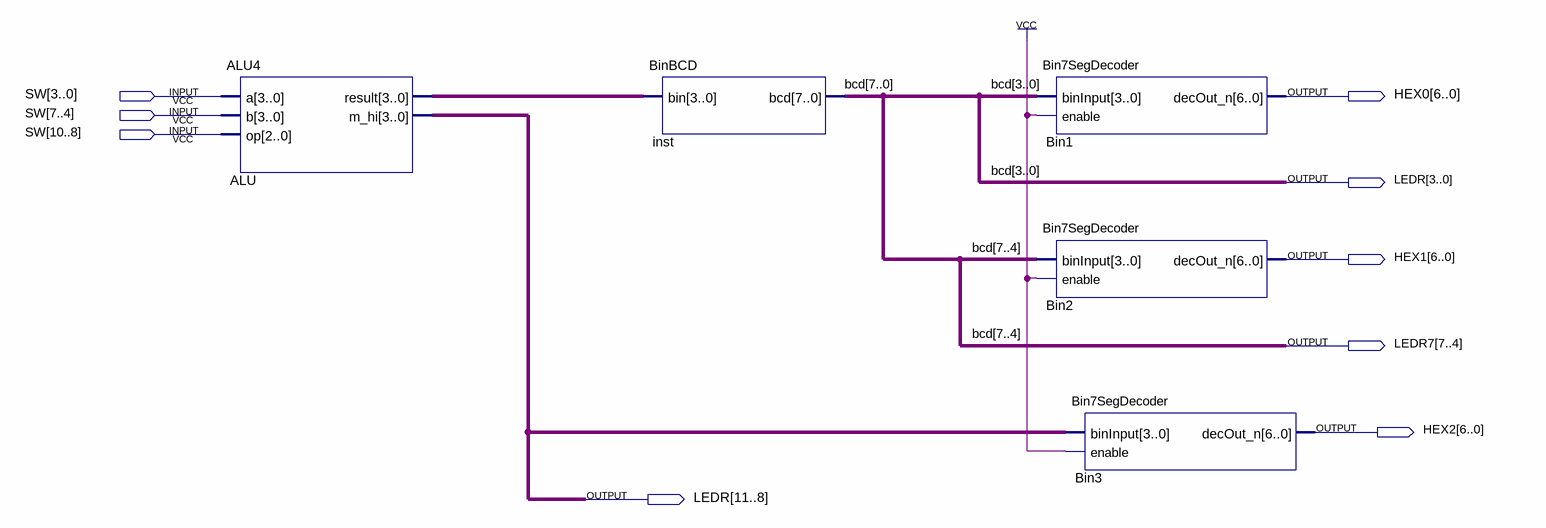
[diagram p0: schematic sheet]
// Quartus schematic ALUDemo.bdf as structural Verilog: 5 symbols, 9 pins
module ALUDemo (
  input  [10:0] SW,
  output [6:0] HEX0,
  output [11:0] LEDR,
  output [6:0] HEX1,
  output [7:4] LEDR7,
  output [6:0] HEX2
);

  wire [3:0] ALU_result;

  ALU4 ALU (.a(SW[3:0]), .b(SW[7:4]), .op(SW[10:8]), .result(ALU_result), .m_hi(LEDR[11:8]));
  BinBCD inst (.bin(ALU_result), .bcd({LEDR7, LEDR[3:0]}));
  Bin7SegDecoder Bin1 (.binInput(LEDR[3:0]), .enable(1'b1), .decOut_n(HEX0));
  Bin7SegDecoder Bin2 (.binInput(LEDR7), .enable(1'b1), .decOut_n(HEX1));
  Bin7SegDecoder Bin3 (.binInput(LEDR[11:8]), .enable(1'b1), .decOut_n(HEX2));

  // Other names for the same wires on the sheet: bcd[7:0] = {LEDR7, LEDR[3:0]}
endmodule
